# EAGLE schematic nixie (EAGLE 6.2)
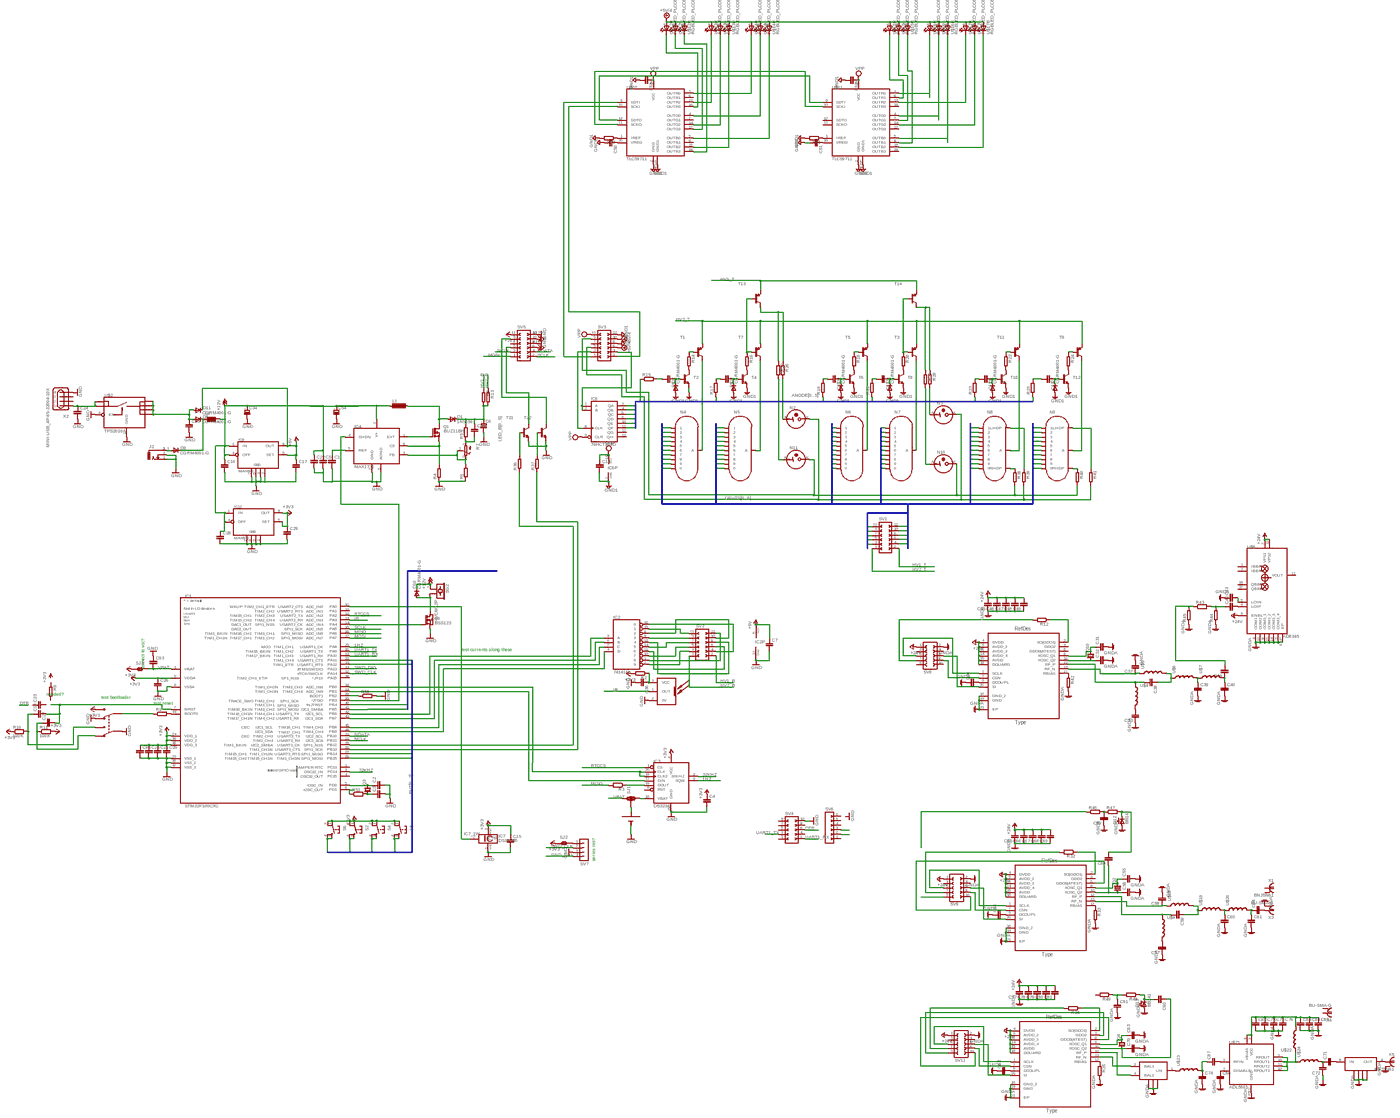
[diagram p0: schematic, sheet 1, overview]
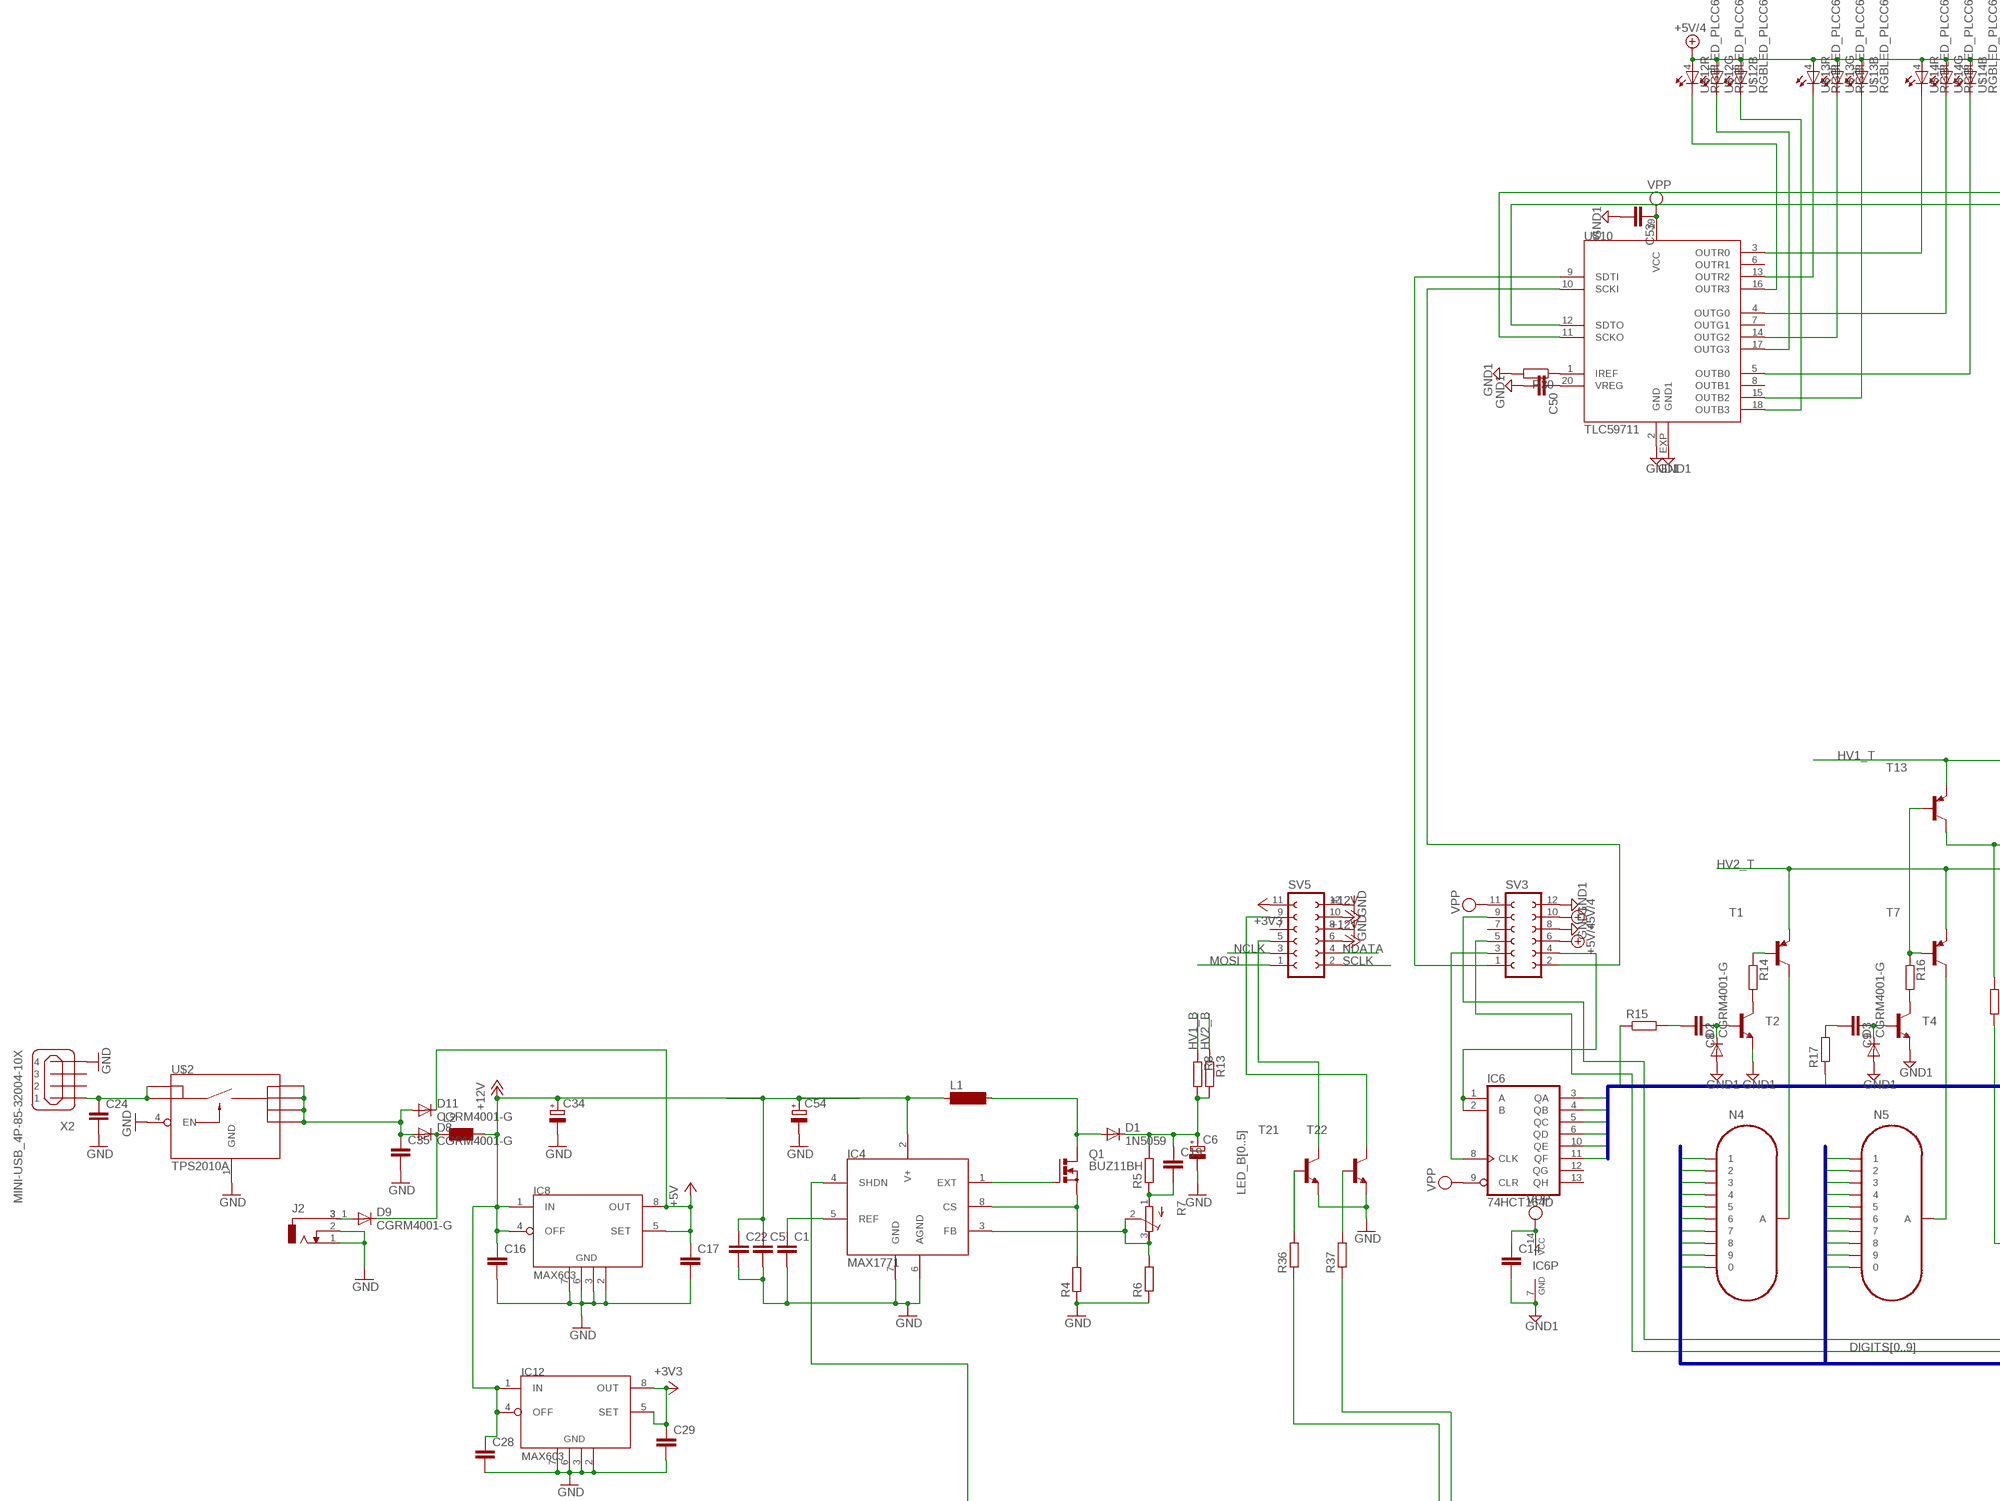
[diagram p1: schematic, sheet 1, part 1 of 4]
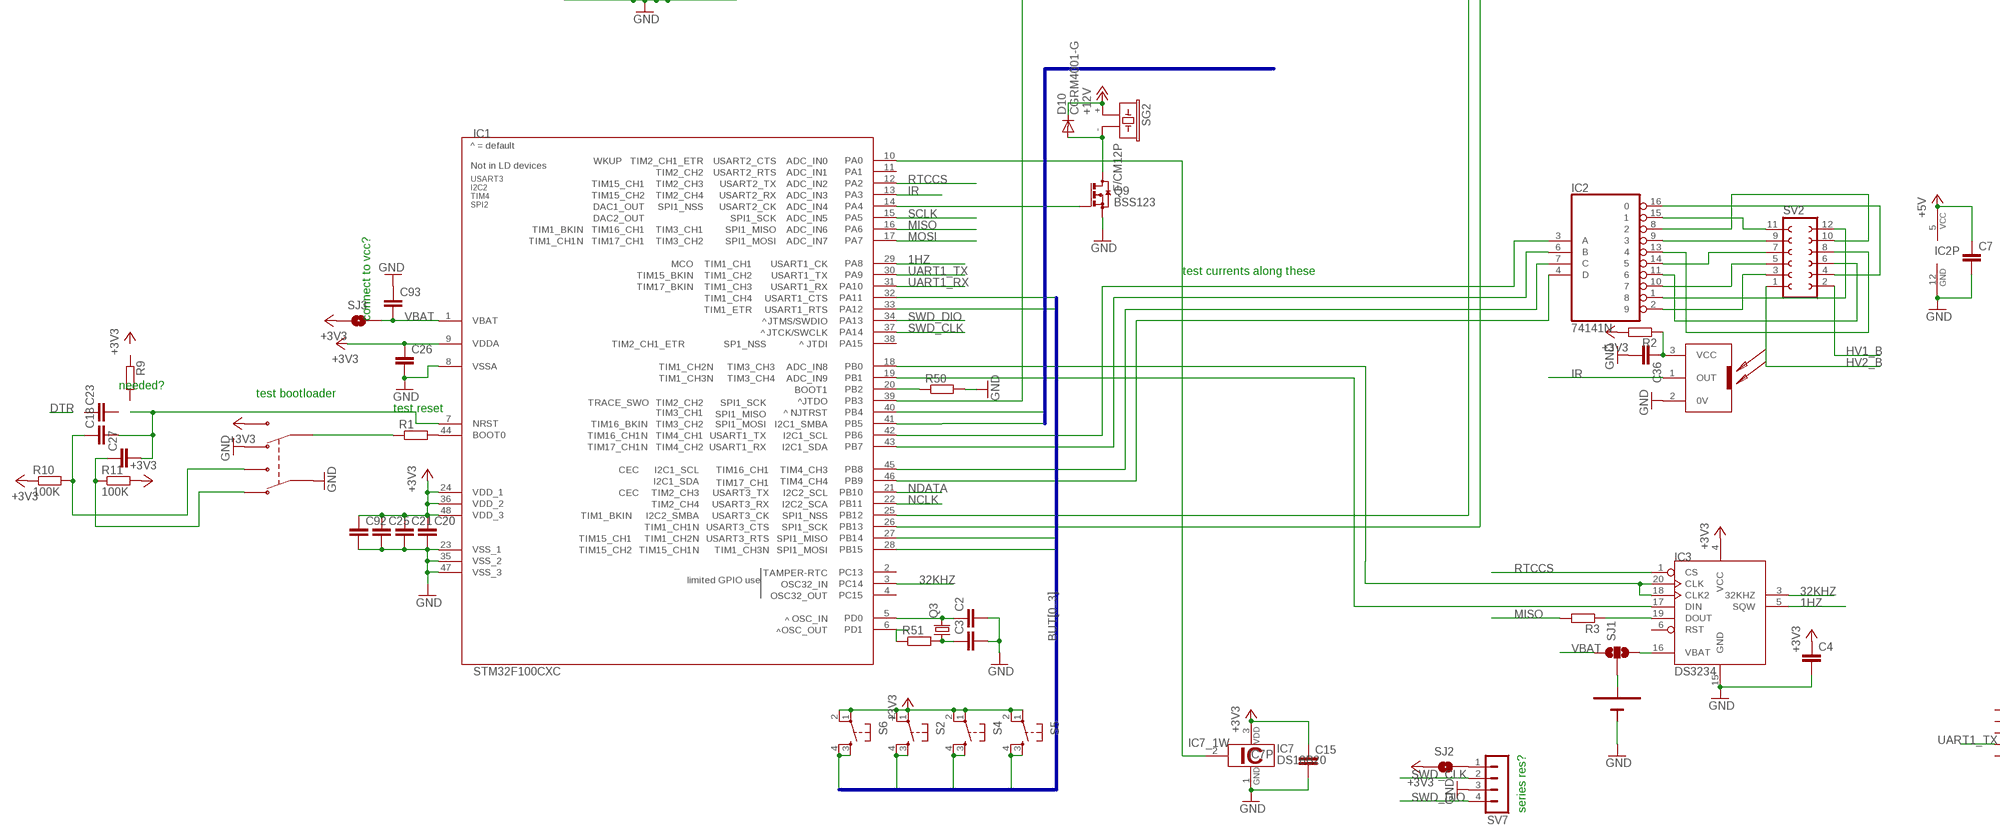
[diagram p2: schematic, sheet 1, part 2 of 4]
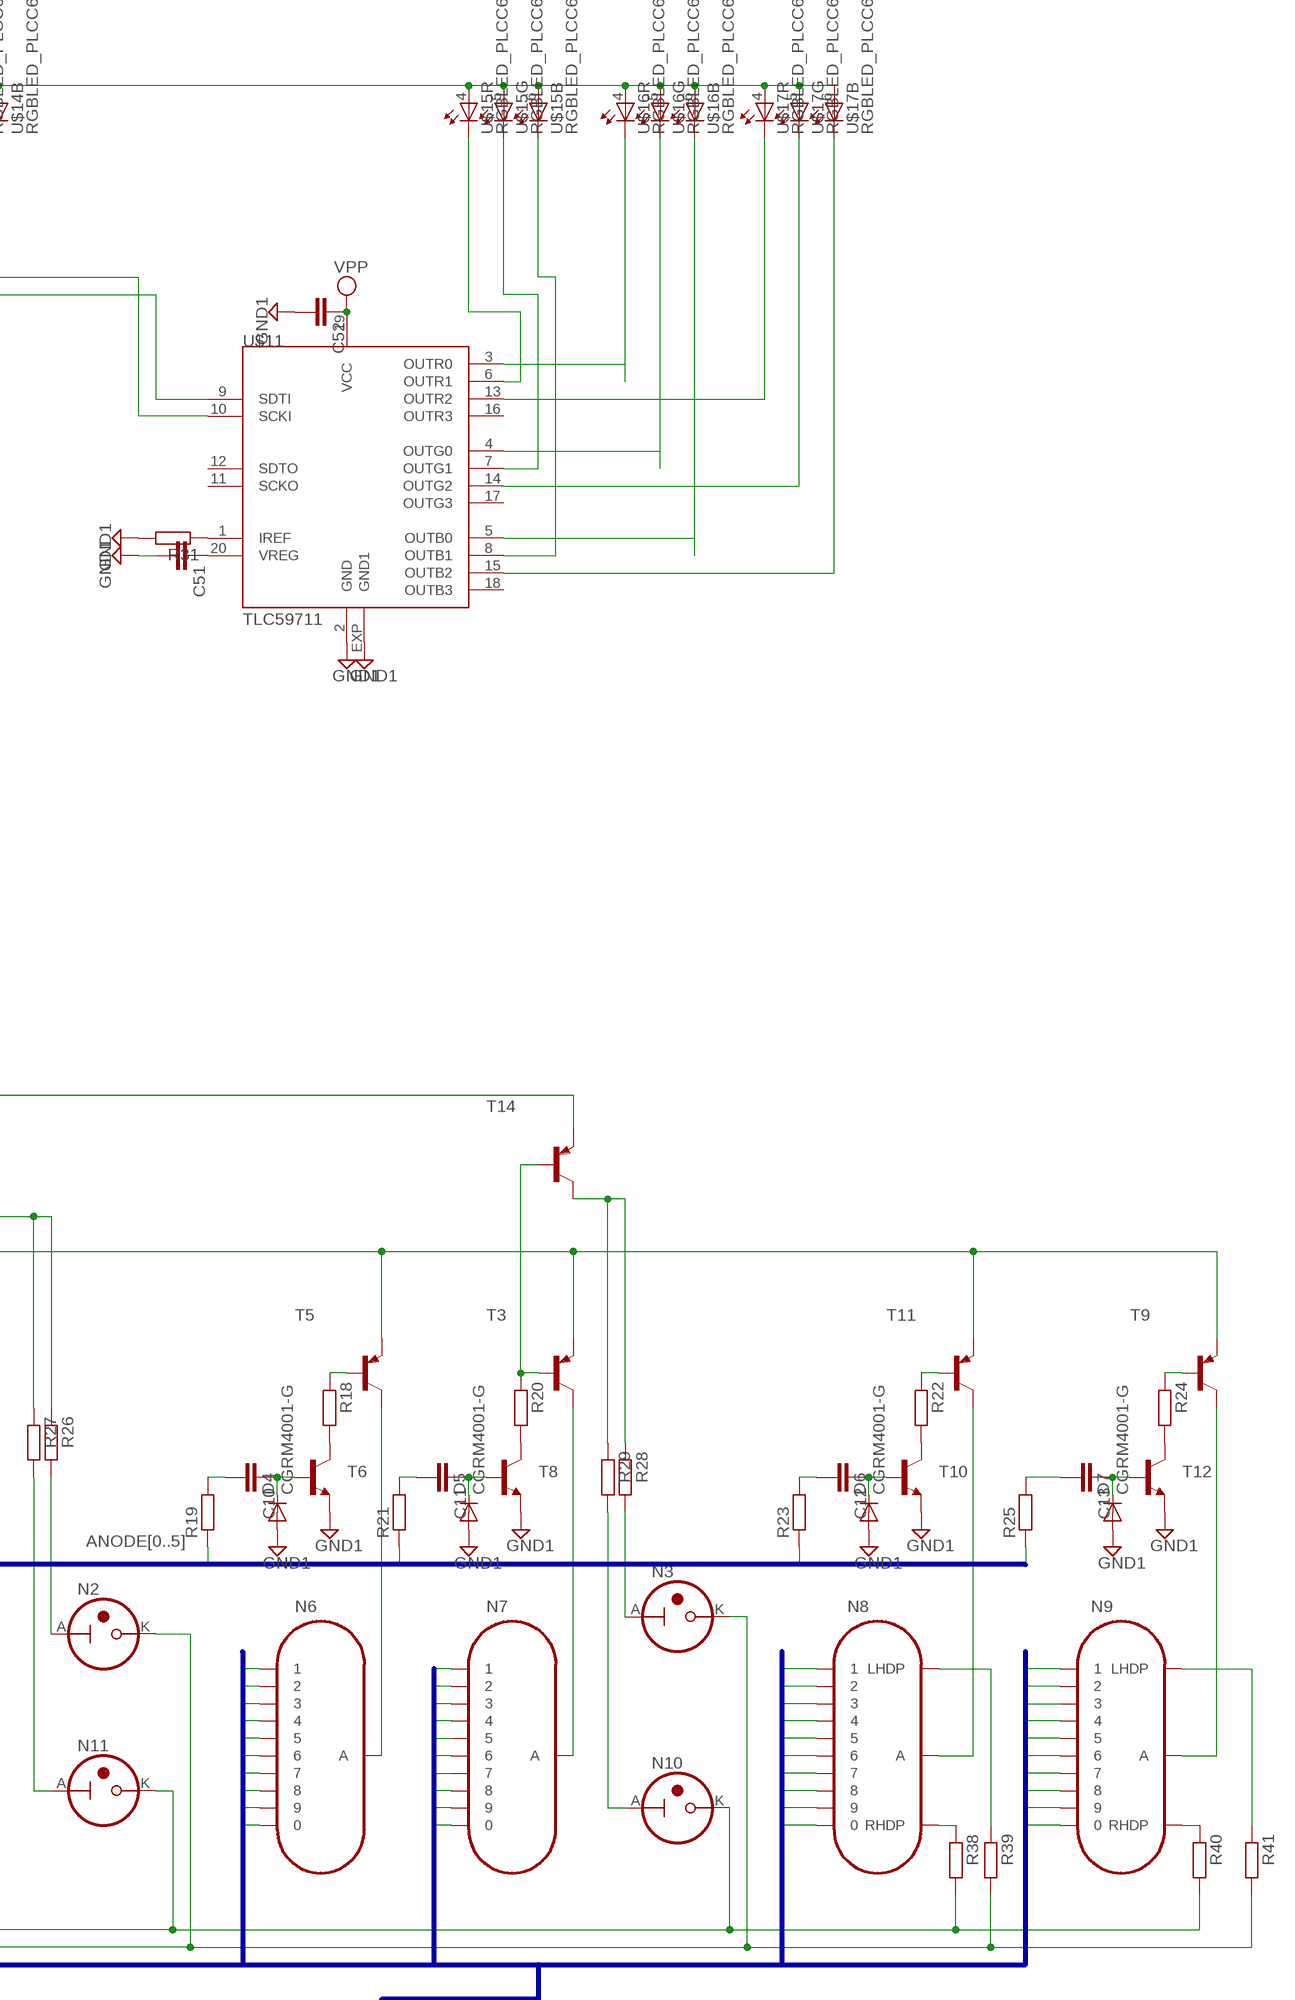
[diagram p3: schematic, sheet 1, part 3 of 4]
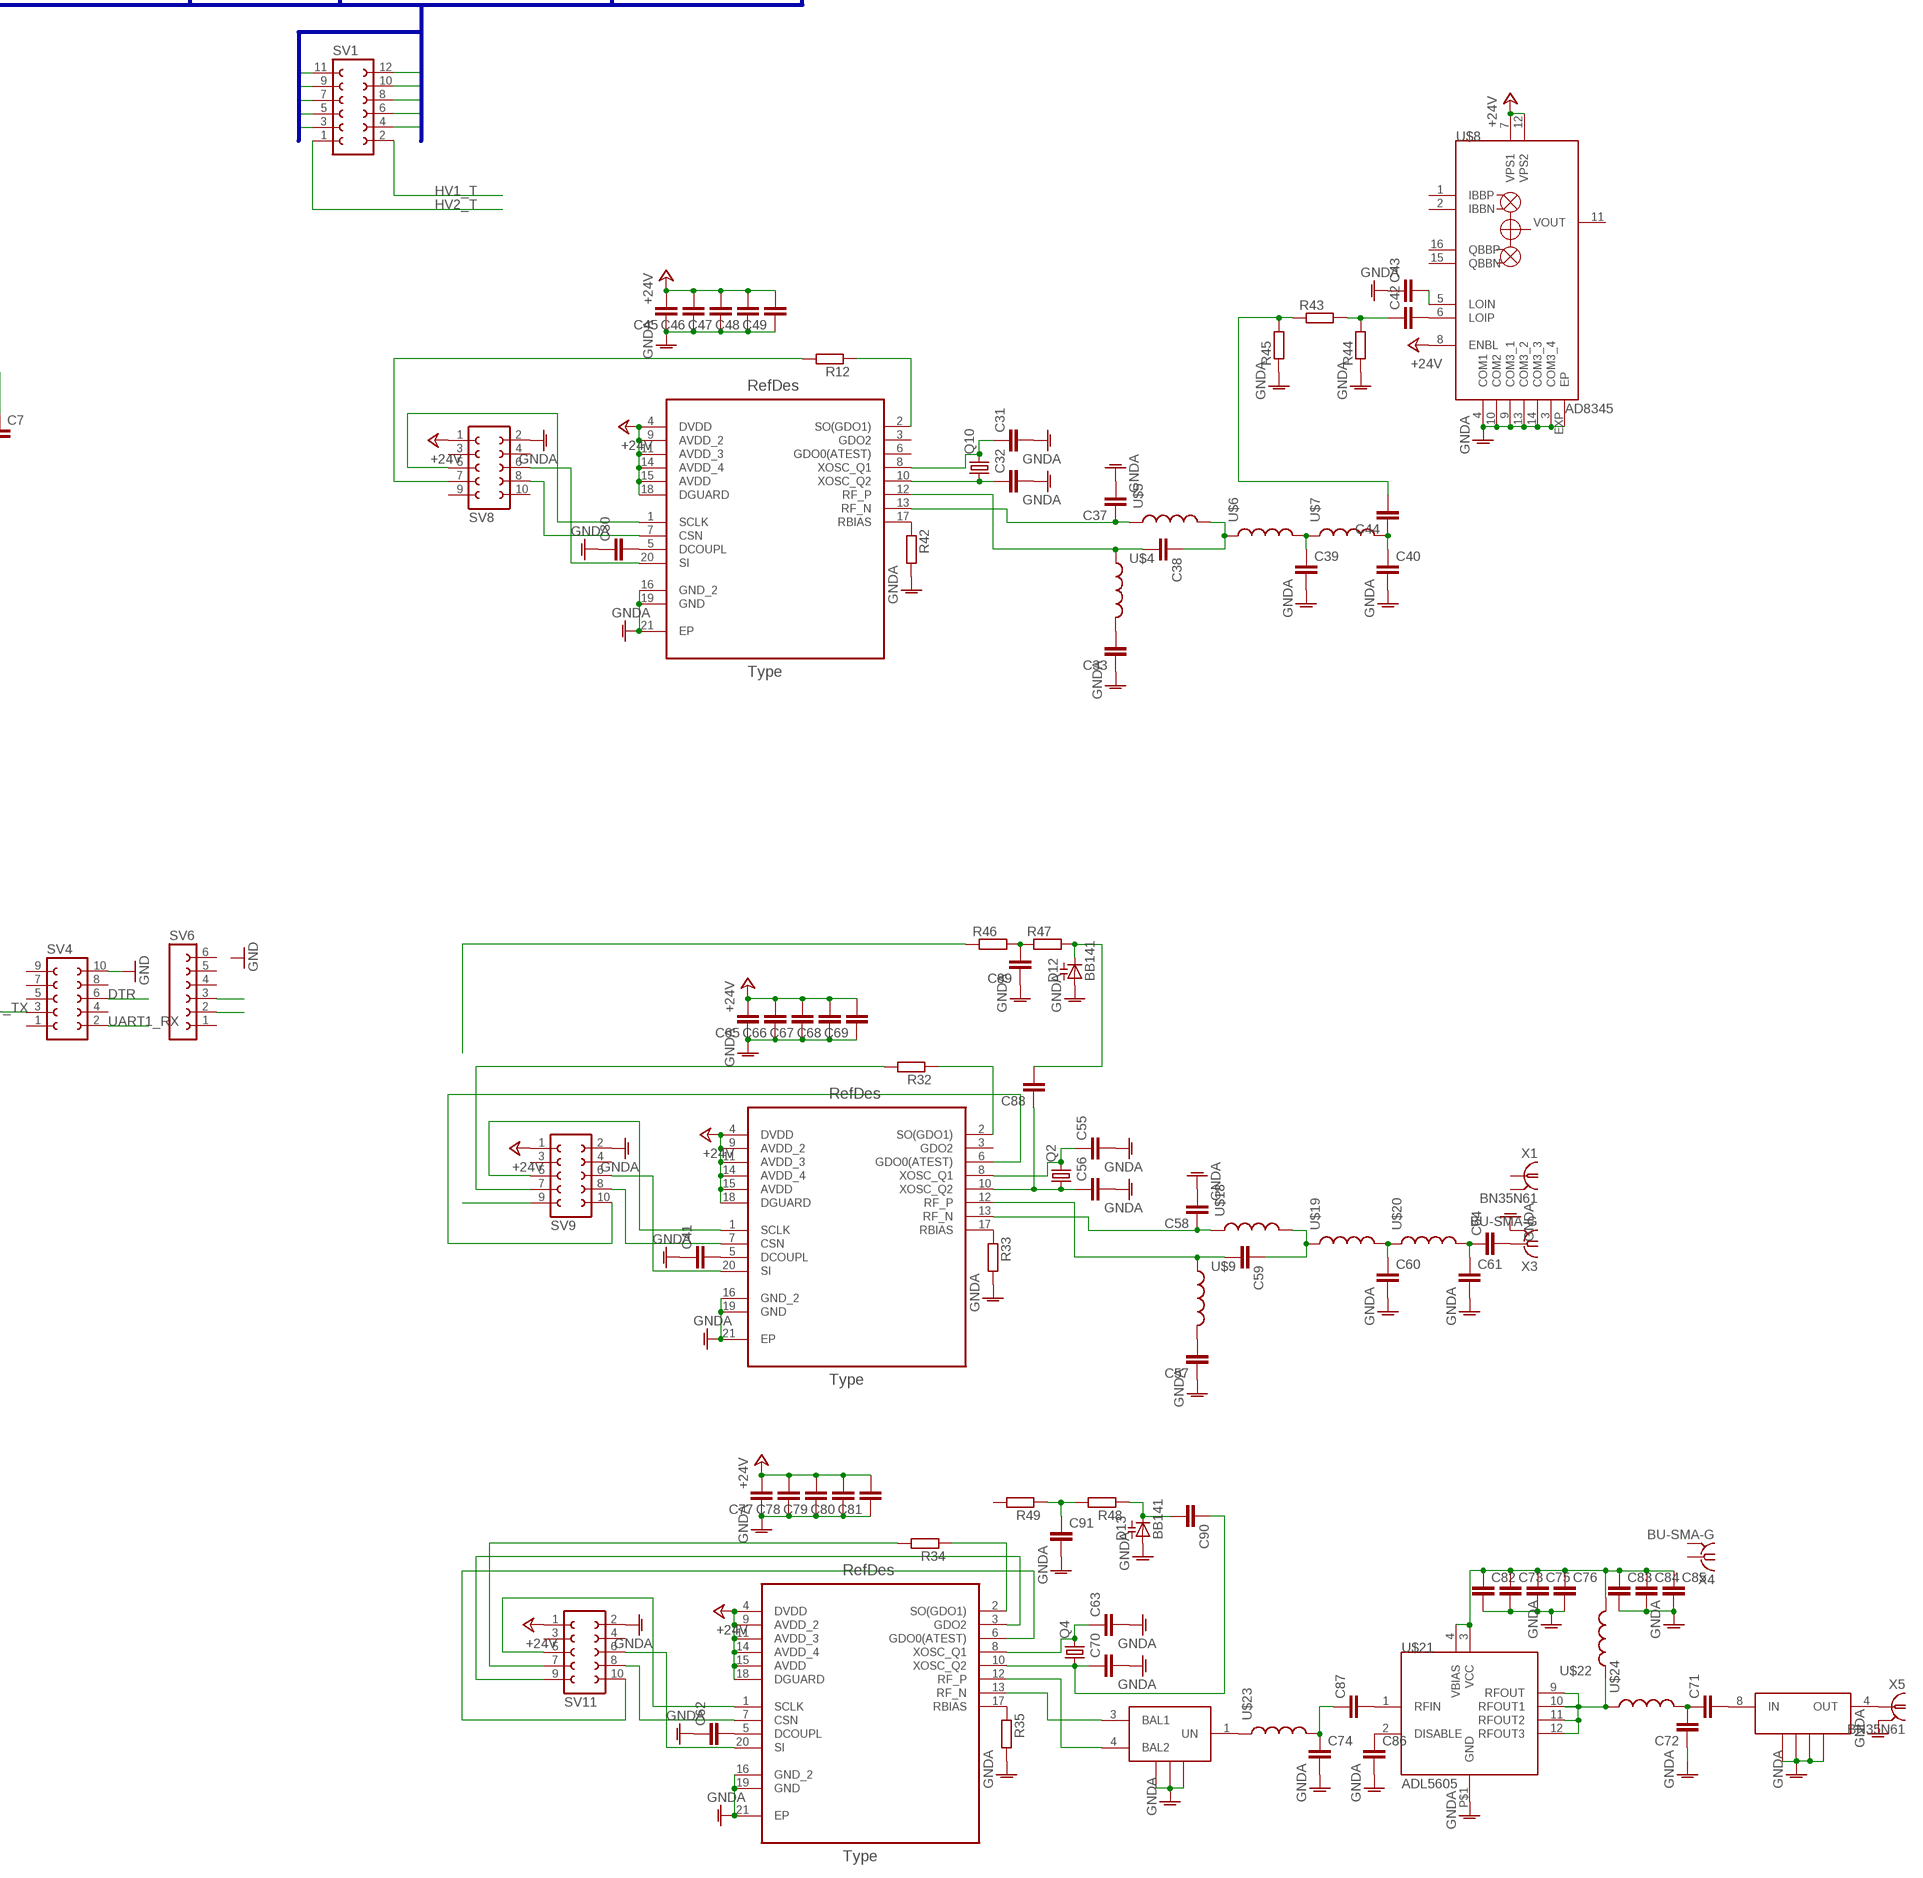
[diagram p4: schematic, sheet 1, part 4 of 4]

## Parts
BAT1  2032  [COIN]
C1  C-EUC0603  [C0603]
C2  C-EUC0603  [C0603]
C3  C-EUC0603  [C0603]
C4  C-EUC0603  [C0603]
C5  C-EUC0603  [C0603]
C6  CPOL-EUE2.5-6  [E2,5-6]
C7  C-EUC0603  [C0603]
C8  C-EUC0603  [C0603]
C9  C-EUC0603  [C0603]
C10  C-EUC0603  [C0603]
C11  C-EUC0603  [C0603]
C12  C-EUC0603  [C0603]
C13  C-EUC0603  [C0603]
C14  C-EUC0603  [C0603]
C15  C-EUC0603  [C0603]
C16  C-EUC0603  [C0603]
C17  C-EUC0603  [C0603]
C18  C-EUC0603  [C0603]
C19  C-EUC0603  [C0603]
C20  C-EUC0603  [C0603]
C21  C-EUC0603  [C0603]
C22  C-EUC0603  [C0603]
C23  C-EUC0603  [C0603]
C24  C-EUC1206  [C1206]
C25  C-EUC0603  [C0603]
C26  C-EUC0603  [C0603]
C27  C-EUC0603  [C0603]
C28  C-EUC0603  [C0603]
C29  C-EUC0603  [C0603]
C30  C-EUC0603  [C0603]
C31  C-EUC0603  [C0603]
C32  C-EUC0603  [C0603]
C33  C-EUC0603  [C0603]
C34  CPOL-EUSMCC  [SMC_C]
C35  C-EUC0603  [C0603]
C36  C-EUC0603  [C0603]
C37  C-EUC0603  [C0603]
C38  C-EUC0603  [C0603]
C39  C-EUC0603  [C0603]
C40  C-EUC0603  [C0603]
C41  C-EUC0603  [C0603]
C42  C-EUC0603  [C0603]
C43  C-EUC0603  [C0603]
C44  C-EUC0603  [C0603]
C45  C-EUC0603  [C0603]
C46  C-EUC0603  [C0603]
C47  C-EUC0603  [C0603]
C48  C-EUC0603  [C0603]
C49  C-EUC0603  [C0603]
C50  C-EUC0603  [C0603]
C51  C-EUC0603  [C0603]
C52  C-EUC0603  [C0603]
C53  C-EUC0603  [C0603]
C54  CPOL-EUE2.5-6  [E2,5-6]
C55  C-EUC0603  [C0603]
C56  C-EUC0603  [C0603]
C57  C-EUC0603  [C0603]
C58  C-EUC0603  [C0603]
C59  C-EUC0603  [C0603]
C60  C-EUC0603  [C0603]
C61  C-EUC0603  [C0603]
C62  C-EUC0603  [C0603]
C63  C-EUC0603  [C0603]
C64  C-EUC0603  [C0603]
C65  C-EUC0603  [C0603]
C66  C-EUC0603  [C0603]
C67  C-EUC0603  [C0603]
C68  C-EUC0603  [C0603]
C69  C-EUC0603  [C0603]
C70  C-EUC0603  [C0603]
C71  C-EUC0603  [C0603]
C72  C-EUC0603  [C0603]
C73  C-EUC0603  [C0603]
C74  C-EUC0603  [C0603]
C75  C-EUC0603  [C0603]
C76  C-EUC0603  [C0603]
C77  C-EUC0603  [C0603]
C78  C-EUC0603  [C0603]
C79  C-EUC0603  [C0603]
C80  C-EUC0603  [C0603]
C81  C-EUC0603  [C0603]
C82  C-EUC0603  [C0603]
C83  C-EUC0603  [C0603]
C84  C-EUC0603  [C0603]
C85  C-EUC0603  [C0603]
C86  C-EUC0603  [C0603]
C87  C-EUC0603  [C0603]
C88  C-EUC0603  [C0603]
C89  C-EUC0603  [C0603]
C90  C-EUC0603  [C0603]
C91  C-EUC0603  [C0603]
C92  C-EUC0603  [C0603]
C93  C-EUC0603  [C0603]
D1  1N5059  DIODE-C1702-05  [C1702-05]
D2  CGRM4001-G  DIODESOD  [SOD-323]
D3  CGRM4001-G  DIODESOD  [SOD-323]
D4  CGRM4001-G  DIODESOD  [SOD-323]
D5  CGRM4001-G  DIODESOD  [SOD-323]
D6  CGRM4001-G  DIODESOD  [SOD-323]
D7  CGRM4001-G  DIODESOD  [SOD-323]
D8  CGRM4001-G  [SOD-123_MINI-SMA]
D9  CGRM4001-G  [SOD-123_MINI-SMA]
D10  CGRM4001-G  [SOD-123_MINI-SMA]
D11  CGRM4001-G  [SOD-123_MINI-SMA]
D12  BB141  [SOD523]
D13  BB141  [SOD523]
IC1  STM32F100CXC  [SQFP-S-7X7-48]
IC2  74141N  [DIL16]
IC3  DS3234  [SO20W]
IC4  MAX1771  [SO08]
IC6  74HCT164D  [SO14]
IC7  DS18B20  [TO92-]
IC8  MAX603  [SO08]
IC12  MAX603  [SO08]
J2  DCJ0303SMD  [SMD_JACK]
L1  BS11  [BS11]
L2  WE-CBF_0805  [0805]
N2  IN-3  [IN-3]
N3  IN-3  [IN-3]
N4  IN-8  [IN-8]
N5  IN-8  [IN-8]
N6  IN-8  [IN-8]
N7  IN-8  [IN-8]
N8  IN-16  [IN-16]
N9  IN-16  [IN-16]
N10  IN-3  [IN-3]
N11  IN-3  [IN-3]
Q1  BUZ11BH  [TO220BH]
Q2  CRYSTAL5X3  [CRYSTAL-SMD-5X3]
Q3  CRYSTALCTS406  [CTS406]
Q4  CRYSTAL5X3  [CRYSTAL-SMD-5X3]
Q9  BSS123  [SOT23]
Q10  CRYSTAL5X3  [CRYSTAL-SMD-5X3]
R1  R-EU_R0603  [R0603]
R2  R-EU_R0603  [R0603]
R3  R-EU_R0603  [R0603]
R4  SMR-WAV  [SMS-WAV]
R5  R-EU_R0603  [R0603]
R6  R-EU_R0603  [R0603]
R7  R-TRIMM3314J  [RTRIM3314J]
R8  R-EU_R0805  [R0805]
R9  R-EU_R0805  [R0805]
R10  100K  R-EU_R0603  [R0603]
R11  100K  R-EU_R0603  [R0603]
R12  R-EU_R0603  [R0603]
R13  R-EU_R0805  [R0805]
R14  R-EU_R0603  [R0603]
R15  R-EU_R0603  [R0603]
R16  R-EU_R0603  [R0603]
R17  R-EU_R0603  [R0603]
R18  R-EU_R0603  [R0603]
R19  R-EU_R0603  [R0603]
R20  R-EU_R0603  [R0603]
R21  R-EU_R0603  [R0603]
R22  R-EU_R0603  [R0603]
R23  R-EU_R0603  [R0603]
R24  R-EU_R0603  [R0603]
R25  R-EU_R0603  [R0603]
R26  R-EU_R0603  [R0603]
R27  R-EU_R0603  [R0603]
R28  R-EU_R0603  [R0603]
R29  R-EU_R0603  [R0603]
R30  R-EU_R0603  [R0603]
R31  R-EU_R0603  [R0603]
R32  R-EU_R0603  [R0603]
R33  R-EU_R0603  [R0603]
R34  R-EU_R0603  [R0603]
R35  R-EU_R0603  [R0603]
R36  R-EU_R0603  [R0603]
R37  R-EU_R0603  [R0603]
R38  R-EU_R0603  [R0603]
R39  R-EU_R0603  [R0603]
R40  R-EU_R0603  [R0603]
R41  R-EU_R0603  [R0603]
R42  R-EU_R0603  [R0603]
R43  R-EU_R0603  [R0603]
R44  R-EU_R0603  [R0603]
R45  R-EU_R0603  [R0603]
R46  R-EU_R0603  [R0603]
R47  R-EU_R0603  [R0603]
R48  R-EU_R0603  [R0603]
R49  R-EU_R0603  [R0603]
R50  R-EU_R0603  [R0603]
R51  R-EU_R0603  [R0603]
S2  TAC_SWITCHPTH  [TACTILE-PTH]
S4  TAC_SWITCHPTH  [TACTILE-PTH]
S5  TAC_SWITCHPTH  [TACTILE-PTH]
S6  TAC_SWITCHPTH  [TACTILE-PTH]
SG2  F/CM12P  [F/CM12P]
SJ1  SOLDERJUMPER_2WAYS  [SJ_3]
SJ2  SOLDERJUMPERNO  [SJ_2S-NO]
SJ3  SOLDERJUMPERNO  [SJ_2S-NO]
SV1  FE06-2  [FE06-2]
SV2  FE06-2  [FE06-2]
SV3  FE06-2  [FE06-2]
SV4  FE05-2WED  [EDGE_10]
SV5  FE06-2  [FE06-2]
SV6  FE06-1ED  [EDGE_6]
SV7  MA04-1E  [EDGE_4]
SV8  FE05-2  [FE05-2]
SV9  FE05-2  [FE05-2]
SV11  FE05-2  [FE05-2]
T1  BC807-16-PNP-SOT23-BEC  [SOT23-BEC]
T2  TRANSISTOR_NPNSOT23-3  [SOT23-3]
T3  BC807-16-PNP-SOT23-BEC  [SOT23-BEC]
T4  TRANSISTOR_NPNSOT23-3  [SOT23-3]
T5  BC807-16-PNP-SOT23-BEC  [SOT23-BEC]
T6  TRANSISTOR_NPNSOT23-3  [SOT23-3]
T7  BC807-16-PNP-SOT23-BEC  [SOT23-BEC]
T8  TRANSISTOR_NPNSOT23-3  [SOT23-3]
T9  BC807-16-PNP-SOT23-BEC  [SOT23-BEC]
T10  TRANSISTOR_NPNSOT23-3  [SOT23-3]
T11  BC807-16-PNP-SOT23-BEC  [SOT23-BEC]
T12  TRANSISTOR_NPNSOT23-3  [SOT23-3]
T13  BC807-16-PNP-SOT23-BEC  [SOT23-BEC]
T14  BC807-16-PNP-SOT23-BEC  [SOT23-BEC]
T21  -NPN-TO92-EBC  [TO92-EBC]
T22  -NPN-TO92-EBC  [TO92-EBC]
U1  CC1101RTK  [QFN50P400X400X90-21N]
U2  CC1101RTK  [QFN50P400X400X90-21N]
U3  CC1101RTK  [QFN50P400X400X90-21N]
U$1  IRREC  [IRREC]
U$2  TPS2010A  [SO-08]
U$3  DPDTSLIDE  [DPDTSLIDE]
U$4  INDUCTOR0402  [C0402]
U$5  INDUCTOR0402  [C0402]
U$6  INDUCTOR0402  [C0402]
U$7  INDUCTOR0402  [C0402]
U$8  AD8345  [TSSOP16EXP]
U$9  INDUCTOR0402  [C0402]
U$10  TLC59711  [HTSSOP20PWP]
U$11  TLC59711  [HTSSOP20PWP]
U$12  RGBLED_PLCC6  [PLCC6]
U$13  RGBLED_PLCC6  [PLCC6]
U$14  RGBLED_PLCC6  [PLCC6]
U$15  RGBLED_PLCC6  [PLCC6]
U$16  RGBLED_PLCC6  [PLCC6]
U$17  RGBLED_PLCC6  [PLCC6]
U$18  INDUCTOR0402  [C0402]
U$19  INDUCTOR0402  [C0402]
U$20  INDUCTOR0402  [C0402]
U$21  ADL5605  [LFCSP_VQ_16]
U$22  INDUCTOR0402  [C0402]
U$23  INDUCTOR0402  [C0402]
U$24  INDUCTOR0402  [C0402]
X1  BN35N61  [B35N61]
X2  MINI-USB_4P-85-32004-10X  [85-32004-10X]
X3  BU-SMA-G  [BU-SMA-G]
X4  BU-SMA-G  [BU-SMA-G]
X5  BN35N61  [B35N61]
X6  LFL21902MTC1A018  [LFL21_TC]
X7  0896BM15A0001  [0896BM15A0001]

## Nets
1HZ: IC1.29(PA8) IC3.5(SQW)
32KHZ: IC1.3(PC14) IC3.3(32KHZ)
+3V3: C4.1 C15.1 C20.1 C21.1 C25.1 C26.1 C29.1 C92.1 IC1.9(VDDA) IC1.24(VDD_1) IC1.36(VDD_2) IC1.48(VDD_3) IC3.4(VCC) IC7.3 IC12.5(SET) IC12.8(OUT) R2.2 R10.1 R11.2 S2.1 S2.2 S4.1 S4.2 S5.1 S5.2 S6.1 S6.2 SJ2.1 SJ3.1 SV5.11 U$3.2B(NO1)
+5V: C7.1 C17.1 D11.C IC2.5(VCC) IC8.5(SET) IC8.8(OUT)
+5V/4: SV3.6 SV3.10 U$12.4(R:A) U$12.5(G:A) U$12.6(B:A) U$13.4(R:A) U$13.5(G:A) U$13.6(B:A) U$14.4(R:A) U$14.5(G:A) U$14.6(B:A) U$15.4(R:A) U$15.5(G:A) U$15.6(B:A) U$16.4(R:A) U$16.5(G:A) U$16.6(B:A) U$17.4(R:A) U$17.5(G:A) U$17.6(B:A)
+12V: C5.1 C16.1 C22.1 C28.1 C34.+ C54.+ D10.C IC4.2(V+) IC8.1(IN) IC8.4(OFF) IC12.1(IN) IC12.4(OFF) L1.1 L2.2 SG2.+ SV5.6 SV5.10
+24V: C45.2 C46.2 C47.2 C48.2 C49.2 C65.2 C66.2 C67.2 C68.2 C69.2 C77.2 C78.2 C79.2 C80.2 C81.2 SV8.1 SV9.1 SV11.1 U1.4(DVDD) U1.9(AVDD_2) U1.11(AVDD_3) U1.14(AVDD_4) U1.15(AVDD) U1.18(DGUARD) U2.4(DVDD) U2.9(AVDD_2) U2.11(AVDD_3) U2.14(AVDD_4) U2.15(AVDD) U2.18(DGUARD) U3.4(DVDD) U3.9(AVDD_2) U3.11(AVDD_3) U3.14(AVDD_4) U3.15(AVDD) U3.18(DGUARD) U$8.7(VPS1) U$8.8(ENBL) U$8.12(VPS2)
ANODE0: IC6.3(QA) R15.1
ANODE1: IC6.4(QB) R17.1
ANODE2: IC6.5(QC) R19.1
ANODE3: IC6.6(QD) R21.1
ANODE4: IC6.10(QE) R23.1
ANODE5: IC6.11(QF) R25.1
BUT0: IC1.32(PA11) S5.3 S5.4
BUT1: IC1.33(PA12) S6.3 S6.4
BUT2: IC1.28(PB15) S4.3 S4.4
BUT3: IC1.27(PB14) S2.3 S2.4
DIGITS0: N4.0 N5.0 N6.0 N7.0 N8.0 N9.0 SV1.3
DIGITS1: N4.1 N5.1 N6.1 N7.1 N8.1 N9.1 SV1.12
DIGITS2: N4.2 N5.2 N6.2 N7.2 N8.2 N9.2 SV1.5
DIGITS3: N4.3 N5.3 N6.3 N7.3 N8.3 N9.3 SV1.6
DIGITS4: N4.4 N5.4 N6.4 N7.4 N8.4 N9.4 SV1.7
DIGITS5: N4.5 N5.5 N6.5 N7.5 N8.5 N9.5 SV1.8
DIGITS6: N4.6 N5.6 N6.6 N7.6 N8.6 N9.6 SV1.9
DIGITS7: N4.7 N5.7 N6.7 N7.7 N8.7 N9.7 SV1.10
DIGITS8: N4.8 N5.8 N6.8 N7.8 N8.8 N9.8 SV1.11
DIGITS9: N4.9 N5.9 N6.9 N7.9 N8.9 N9.9 SV1.4
DTR: SV4.6
GND: BAT1.- C1.2 C2.2 C3.2 C4.2 C5.2 C6.- C7.2 C15.2 C16.2 C17.2 C20.2 C21.2 C22.2 C24.2 C25.2 C26.2 C28.2 C29.2 C34.- C35.2 C36.2 C54.- C92.2 C93.1 IC1.8(VSSA) IC1.23(VSS_1) IC1.35(VSS_2) IC1.47(VSS_3) IC2.12(GND) IC3.15(GND) IC4.6(AGND) IC4.7(GND) IC7.1 IC8.2(GND4) IC8.3(GND3) IC8.6(GND2) IC8.7(GND1) IC12.2(GND4) IC12.3(GND3) IC12.7(GND1) J2.1 J2.2 Q9.2(S) R4.2 R6.1 R50.2 SV4.10 SV5.8 SV5.12 SV7.3 T21.E T22.E U$1.2(0V) U$2.1(GND) U$2.4(EN) U$3.1X(COM0) U$3.2A(NC1) X2.4
GND1: C14.2 C50.2 C51.2 C52.2 C53.2 D2.2(A) D3.2(A) D4.2(A) D5.2(A) D6.2(A) D7.2(A) IC6.7(GND) R30.2 R31.2 SV3.8 SV3.12 T2.2(E) T4.2(E) T6.2(E) T8.2(E) T10.2(E) T12.2(E) U$10.2(GND) U$10.EXP(GND1) U$11.2(GND) U$11.EXP(GND1)
GNDA: C30.1 C31.2 C32.2 C33.1 C37.2 C39.2 C40.2 C41.1 C43.1 C45.1 C46.1 C47.1 C48.1 C49.1 C55.2 C56.2 C57.1 C58.2 C60.2 C61.2 C62.1 C63.2 C65.1 C66.1 C67.1 C68.1 C69.1 C70.2 C72.1 C73.2 C74.2 C75.2 C76.2 C77.1 C78.1 C79.1 C80.1 C81.1 C82.2 C83.2 C84.2 C85.2 C86.2 C89.1 C91.2 D12.A D13.A R33.2 R35.2 R42.2 R44.1 R45.1 SV8.2 SV9.2 SV11.2 U1.16(GND_2) U1.19(GND) U1.21(EP) U2.16(GND_2) U2.19(GND) U2.21(EP) U3.16(GND_2) U3.19(GND) U3.21(EP) U$8.3(COM3_4) U$8.4(COM1) U$8.9(COM3_1) U$8.10(COM2) U$8.13(COM3_2) U$8.14(COM3_3) U$8.EXP(EP) U$21.P$1(GND) X3.2(GND) X5.2(GND) X6.1(GND1) X6.3(GND2) X6.5(GND3) X6.7(GND) X7.2(GND2) X7.5(GND) X7.6(GND1)
HV1_B: R8.1 SV2.2
HV1_T: SV1.2 T13.E T14.E
HV2_B: R13.1 SV2.1
HV2_T: SV1.1 T1.E T3.E T5.E T7.E T9.E T11.E
IR: IC1.13(PA3) U$1.1(OUT)
LED5: SV3.2 U$10.10(SCKI)
LED_B0: IC1.41(PB5)
LED_B1: IC1.40(PB4)
MISO: IC1.16(PA6) R3.2
MOSI: IC1.17(PA7) SV5.1
N$1: C41.2 U2.5(DCOUPL)
N$2: IC6.1(A) IC6.2(B) SV3.4
N$3: BAT1.+ SJ1.2
N$4: IC1.25(PB12) R36.1
N$5: IC3.19(DOUT) R3.1
N$6: IC1.42(PB6) IC2.3(A)
N$7: IC3.16(VBAT) SJ1.3
N$8: IC1.19(PB1) IC3.17(DIN)
N$9: IC1.18(PB0) IC3.18(CLK2) IC3.20(CLK)
N$10: IC1.43(PB7) IC2.6(B)
N$11: IC1.45(PB8) IC2.7(C)
N$12: IC1.46(PB9) IC2.4(D)
N$13: IC4.1(EXT) Q1.G
N$14: IC4.8(CS) Q1.S R4.1
N$15: D1.A L1.2 Q1.D
N$16: N3.A R28.2
N$17: C1.1 IC4.5(REF)
N$18: R14.2 T2.3(C)
N$19: SV3.1 U$10.9(SDTI)
N$20: C19.2 R5.1 R7.1(E)
N$21: IC4.3(FB) R6.2 R7.2(S) R7.3(A)
N$22: R14.1 T1.B
N$23: C2.1 IC1.5(PD0) Q3.3
N$24: IC1.44(BOOT0) R1.2
N$25: N4.A T1.C
N$26: C6.+ C19.1 D1.C R5.2 R8.2 R13.2
N$27: C13.1 D7.1(C) T12.1(B)
N$28: N5.A T7.C
N$29: R16.2 T4.3(C)
N$30: R16.1 T7.B T13.B
N$31: C13.2 R25.2
N$32: N6.A T5.C
N$33: R18.2 T6.3(C)
N$34: R18.1 T5.B
N$35: C12.1 D6.1(C) T10.1(B)
N$36: R28.1 R29.1 T14.C
N$37: R20.2 T8.3(C)
N$38: R20.1 T3.B T14.B
N$39: C12.2 R23.2
N$40: N8.A T11.C
N$41: R22.2 T10.3(C)
N$42: R22.1 T11.B
N$43: C11.1 D5.1(C) T8.1(B)
N$44: N9.A T9.C
N$45: R24.2 T12.3(C)
N$46: R24.1 T9.B
N$47: C11.2 R21.2
N$48: IC1.6(PD1) R51.1
N$49: SV9.5 U2.1(SCLK)
N$50: SV9.8 U2.7(CSN)
N$51: SJ2.2 SV7.1
N$52: D9.A J2.3 J2.3_1
N$53: N2.A R26.2
N$54: N11.A R27.2
N$55: D10.A Q9.3(D) SG2.-
N$56: N10.A R29.2
N$57: N10.K N11.K R38.2 R40.2 SV3.9
N$58: C30.2 U1.5(DCOUPL)
N$59: SV9.6 U2.20(SI)
N$60: C56.1 C88.1 Q2.1 U2.10(XOSC_Q2)
N$61: C55.1 Q2.3 U2.8(XOSC_Q1)
N$62: R32.1 U2.2(SO(GDO1))
N$63: R32.2 SV9.7
N$64: C24.1 U$2.2(IN1) U$2.3(IN2) X2.1
N$65: SV8.5 U1.1(SCLK)
N$66: R37.2 T22.B
N$67: R36.2 T21.B
N$68: C18.2 C27.2 IC1.7(NRST)
N$69: C35.1 D8.A D11.A U$2.5(OUT1) U$2.6(OUT2) U$2.7(OUT3) U$2.8(OUT4)
N$70: IC1.14(PA4) Q9.1(G)
N$71: C27.1 R11.1 U$3.1A(NC0)
N$72: SV8.8 U1.7(CSN)
N$73: C18.1 R10.2 U$3.1B(NO0)
N$74: IC1.26(PB13) R37.1
N$75: SV8.6 U1.20(SI)
N$76: C10.1 D4.1(C) T6.1(B)
N$77: C10.2 R19.2
N$78: C9.1 D3.1(C) T4.1(B)
N$79: C32.1 Q10.1 U1.10(XOSC_Q2)
N$80: C9.2 R17.2
N$81: C8.1 D2.1(C) T2.1(B)
N$82: C8.2 R15.2
N$83: N8.RHDP R38.1
N$84: N8.LHDP R39.1
N$85: N9.RHDP R40.1
N$86: N9.LHDP R41.1
N$87: C57.2 U$9.2
N$88: N2.K N3.K R39.2 R41.2 SV3.5
N$89: C31.1 Q10.3 U1.8(XOSC_Q1)
N$90: C33.2 U$4.2
N$91: IC1.10(PA0) IC7.2
N$92: R26.1 R27.1 T13.C
N$93: C39.1 U$6.2 U$7.1
N$94: IC2.16 SV2.4
N$95: N7.A T3.C
N$96: IC2.15 SV2.11
N$97: IC2.9 SV2.9
N$98: IC2.14 SV2.7
N$99: IC2.10 SV2.5
N$100: IC2.8 SV2.10
N$101: IC2.2 SV2.3
N$102: IC2.1 SV2.12
N$103: R12.1 U1.2(SO(GDO1))
N$104: IC2.11 SV2.6
N$105: IC2.13 SV2.8
N$106: R12.2 SV8.7
N$107: C40.1 C44.1 U$7.2
N$108: C38.1 U$5.2 U$6.1
N$109: C37.1 U1.13(RF_N) U$5.1
N$110: C38.2 U1.12(RF_P) U$4.1
N$111: C42.2 U$8.6(LOIP)
N$112: IC6.8(CLK) SV3.3
N$113: SV5.5 T21.C
N$114: SV5.9 T22.C
N$115: R42.1 U1.17(RBIAS)
N$116: C42.1 R43.2 R44.2
N$117: C44.2 R43.1 R45.2
N$118: C43.2 U$8.5(LOIN)
N$119: C60.1 U$19.2 U$20.1
N$120: C61.1 C64.1 U$20.2
N$121: C59.1 U$18.2 U$19.1
N$122: C58.1 U2.13(RF_N) U$18.1
N$123: U$10.16(OUTR3) U$12.3(R:B)
N$124: D8.C D9.C L2.1
N$125: U$10.13(OUTR2) U$13.3(R:B)
N$126: U$10.3(OUTR0) U$14.3(R:B)
N$127: U$10.17(OUTG3) U$12.2(G:B)
N$128: U$10.14(OUTG2) U$13.2(G:B)
N$129: IC1.39(PB3) IC4.4(SHDN)
N$130: U$10.4(OUTG0) U$14.2(G:B)
N$131: C36.1 R2.1 U$1.3(VCC)
N$132: U$10.18(OUTB3) U$12.1(B:B)
N$133: U$10.15(OUTB2) U$13.1(B:B)
N$134: U$10.5(OUTB0) U$14.1(B:B)
N$135: U$11.6(OUTR1) U$15.3(R:B)
N$136: U$11.3(OUTR0) U$16.3(R:B)
N$137: U$11.13(OUTR2) U$17.3(R:B)
N$138: U$11.7(OUTG1) U$15.2(G:B)
N$139: U$11.4(OUTG0) U$16.2(G:B)
N$140: U$11.14(OUTG2) U$17.2(G:B)
N$141: U$11.8(OUTB1) U$15.1(B:B)
N$142: U$11.5(OUTB0) U$16.1(B:B)
N$143: U$11.15(OUTB2) U$17.1(B:B)
N$144: C50.1 U$10.20(VREG)
N$145: R30.1 U$10.1(IREF)
N$146: C51.1 U$11.20(VREG)
N$147: R31.1 U$11.1(IREF)
N$148: U$10.12(SDTO) U$11.9(SDTI)
N$149: U$10.11(SCKO) U$11.10(SCKI)
N$150: C59.2 U2.12(RF_P) U$9.1
N$151: R33.1 U2.17(RBIAS)
N$152: C64.2 X3.1
N$153: SV9.9
N$154: SV9.10 U2.6(GDO0(ATEST))
N$155: C62.2 U3.5(DCOUPL)
N$156: SV11.5 U3.1(SCLK)
N$157: SV11.8 U3.7(CSN)
N$158: SV11.6 U3.20(SI)
N$159: C70.1 C90.1 Q4.1 U3.10(XOSC_Q2)
N$160: C63.1 Q4.3 U3.8(XOSC_Q1)
N$161: R34.1 U3.2(SO(GDO1))
N$162: R34.2 SV11.7
N$163: U3.12(RF_P) X7.4(BAL2)
N$164: C74.1 C87.1 U$23.2
N$165: U3.13(RF_N) X7.3(BAL1)
N$166: U$23.1 X7.1(UN)
N$167: C87.2 U$21.1(RFIN)
N$168: C71.2 X6.8(IN)
N$169: R35.1 U3.17(RBIAS)
N$170: U$21.9(RFOUT) U$21.10(RFOUT1) U$21.11(RFOUT2) U$21.12(RFOUT3) U$22.1 U$24.1
N$171: SV11.9 U3.3(GDO2)
N$172: SV11.10 U3.6(GDO0(ATEST))
N$173: X5.1 X6.4(OUT)
N$174: C71.1 C72.2 U$24.2
N$175: C73.1 C75.1 C76.1 C82.1 C83.1 C84.1 C85.1 U$21.3(VCC) U$21.4(VBIAS) U$22.2
N$176: C88.2 D12.C R47.2
N$177: C86.1 U$21.2(DISABLE)
N$178: C89.2 R46.2 R47.1
N$179: R46.1
N$180: C91.1 R48.2 R49.1
N$181: C90.2 D13.C R48.1
N$182: R1.1 U$3.2X(COM1)
N$183: IC1.20(PB2) R50.1
N$184: C3.1 Q3.1 R51.2
NCLK: IC1.22(PB11) SV5.3
NDATA: IC1.21(PB10) SV5.4
RTCCS: IC1.12(PA2) IC3.1(CS)
RXD: SV6.2
SCLK: IC1.15(PA5) SV5.2
SWD_CLK: IC1.37(PA14) SV7.2
SWD_DIO: IC1.34(PA13) SV7.4
TXD: SV6.3
UART1_RX: IC1.31(PA10) SV4.2
UART1_TX: IC1.30(PA9) SV4.3
VBAT: C93.2 IC1.1(VBAT) SJ1.1 SJ3.2
VPP: C14.1 C52.1 C53.1 IC6.9(CLR) IC6.14(VCC) SV3.11 U$10.19(VCC) U$11.19(VCC)
Unconnected: C23.1 C23.2 IC1.2(PC13) IC1.4(PC15) IC1.11(PA1) IC1.38(PA15) IC3.6(RST) IC6.12(QG) IC6.13(QH) R9.1 R9.2 R49.2 SV3.7 SV4.1 SV4.4 SV4.5 SV4.7 SV4.8 SV4.9 SV5.7 SV6.1 SV6.4 SV6.5 SV6.6 SV8.3 SV8.4 SV8.9 SV8.10 SV9.3 SV9.4 SV11.3 SV11.4 U1.3(GDO2) U1.6(GDO0(ATEST)) U2.3(GDO2) U$8.1(IBBP) U$8.2(IBBN) U$8.11(VOUT) U$8.15(QBBN) U$8.16(QBBP) U$10.6(OUTR1) U$10.7(OUTG1) U$10.8(OUTB1) U$11.11(SCKO) U$11.12(SDTO) U$11.16(OUTR3) U$11.17(OUTG3) U$11.18(OUTB3) X1.1 X2.2 X2.3 X4.1

## Buses
DIGITS[0..9]
ANODE[0..5]
LED_B[0..5]
BUT[0..3]

## Notes on the sheet
- test currents along these
- connect to vcc?
- needed? | test bootloader
- test reset
- series res?

## Power pins joined to a net without a drawn wire
GND: X1.2(GND) X1.3(GND) X1.4(GND) X1.5(GND) X3.3(GND) X3.4(GND) X3.5(GND) X4.2(GND) X4.3(GND) X4.4(GND) X4.5(GND) X5.3(GND) X5.4(GND) X5.5(GND)
GND2: IC12.6(GND2)

## Library data of the parts
BAT1 = Mine:2032
C1-C5 C7-C33 C35-C53 C55-C93 = rcl:C-EU: CAPACITOR, European symbol
C6 C34 C54 = rcl:CPOL-EU: POLARIZED CAPACITOR, European symbol
D1 = diode:DIODE-: DIODE
D2-D7 = SparkFun:DIODE: Diode These are standard reverse protection diodes and small signal diodes. SMA package can handle up to about 1A. SOD-323 can handle about 200mA. What the SOD-323 package when ordering, there are some mfgs out there that are 5-pin packages.
D8-D11 = diode:CGRM400*-G: Molded plasitc,JEDEC SOD-123/Mini SMA Source: Comchip CGRM4001-G.pdf
D12 D13 = diode:BB141: Capacity DIODE variable-capacitance diode
IC1 = Mine:STM32F100CX
IC2 = 74xx-us:74*141: BCD to decimal DECODER/DRIVER
IC3 = Mine:DS3234
IC4 = Mine:MAX1771
IC6 = 74xx-eu:74*164: 8-bit parallel out SHIFT REGISTER
IC7 = 1wire:DS18B20: Programmable Resolution Digital Thermometer This chip provides a onewire thermosensor with approx. 0.5°C accuracy. A programmable over/undertemperure alarm is available. The precision can be set from 9..12 bits. Notes: Vdd must be applied for accurate measurements at low temperatures, as the parasite power circuit otherwise heats the sensor. If parasite power is used, Vdd has to be connected to GND. The DS1822 is a low-cost thermometer chip, the DS18S20 is similar to the DS18B20, but with 9 Bit precision only. Author: Jan Kandziora <jjj@gmx.de>
IC8 IC12 = Mine:MAX603
J2 = Mine:DCJ0303: DC POWER JACK Source: DCJ0303.pdf
L1 = inductor-neosid:BS: INDUCTOR nominal inductance, magnetically screened; OC_FARNELL: unknown; OC_NEWARK: unknown
L2 = wuerth-elektronik:WE-CBF: SMD EMI Suppression Ferrite Beads - excellent anti-EMI properties - low DCR - impedances till 3000 ohms - rated current up to 6 A
N2 N3 N10 N11 = russian-nixies:IN-3: IN-3: nixie bulb
N4-N7 = IN8:IN-8: IN-8: medium numeric frontview nixie tube
N8 N9 = russian-nixies:IN-16: IN-16: small numeric frontview nixie tube
Q1 = Mine:BUZ11: N-CHANNEL MOS FET
Q2 Q4 Q10 = SparkFun:CRYSTAL: Crystals Various standard crystals. Proven footprints. Spark Fun Electronics SKU : COM-00534
Q3 = crystal:CRYSTAL: CRYSTAL; OC_FARNELL: unknown; OC_NEWARK: unknown
Q9 = transistor-small-signal:BSS123: N-CHANNEL MOS FET
R1-R3 R5 R6 R8-R51 = rcl:R-EU_: RESISTOR, European symbol
R4 = resistor-shunt:SMR-WAV: SMD SHUNT RESISTOR; OC_FARNELL: unknown; OC_NEWARK: unknown
R7 = rcl:R-TRIMM: Trimm resistor
S2 S4-S6 = SparkFun:TAC_SWITCH: Momentary Switch Button commonly used for reset or general input. Spark Fun Electronics SKU : COM-00097
SG2 = buzzer:F/CM12P: BUZZER Source: Buerklin; OC_FARNELL: unknown; OC_NEWARK: unknown
SJ1 = SparkFun:SOLDERJUMPER_2WAY: Solder Jumper 2 way solder jumper
SJ2 SJ3 = SparkFun:SOLDERJUMPER: Solder Jumper Standard SMD solder jumper. Used to automate production. Two varients : Normally Open and Normally Closed are the same, but have different paste layers. NC will have a large amount of paste and should jumper during reflow.
SV1-SV3 SV5 = con-lsta:FE06-2: FEMALE HEADER; OC_FARNELL: unknown; OC_NEWARK: unknown
SV4 = Mine:FE05-2W: FEMALE HEADER
SV6 = Mine:FE06-1: FEMALE HEADER
SV7 = Mine:MA04-1: PIN HEADER
SV8 SV9 SV11 = con-lsta:FE05-2: FEMALE HEADER; OC_FARNELL: unknown; OC_NEWARK: unknown
T1 T3 T5 T7 T9 T11 T13 T14 = transistor:*-PNP-: PNP Transistror
T2 T4 T6 T8 T10 T12 = SparkFun:TRANSISTOR_NPN: Transistor NPN BJT configuration in SOT23 package. MMBT2222 is the common NPN we use. Double check BCE configuration again layout.
T21 T22 = transistor:*-NPN-: NPN Transistror BF959 corrected 2008.03.06
U1-U3 = cc1101:CC1101RTK; DESCRIPTION: Low-Power Sub-1 GHz RF Transceiver; MPN: CC1101RTK; OC_FARNELL: 1555264; OC_NEWARK: 50M8833; PACKAGE: QFN-20; SUPPLIER: Texas Instruments
U$1 = Mine:IRREC
U$2 = Mine:TPS2010A
U$3 = Mine:DPDTSLIDE
U$4-U$7 U$9 U$18-U$20 U$22-U$24 = SparkFun:INDUCTOR: Inductors Basic Inductor/Choke - 0603 and 1206. Footprints are not proven and vary greatly between part numbers.
U$8 = ad8345 - Copy:AD8345
U$10 U$11 = IN8:TLC59711
U$12-U$17 = IN8:RGBLED_PLCC6
U$21 = ad8345:ADL5605
X1 X5 = con-coax:BN35N61: BNC CONNECTOR M/A COM www.macom.com distributor Farnell 149-452; OC_FARNELL: unknown; OC_NEWARK: unknown
X2 = con-cypressindustries:MINI-USB_4P-: MINI USB 4 Pol. Source: www.cypressindustries.com; OC_FARNELL: unknown; OC_NEWARK: unknown
X3 X4 = con-coax:BU-SMA-G: FEMALE SMA CONNECTOR Radiall distributor RS 193-9117; OC_FARNELL: unknown; OC_NEWARK: unknown
X6 = ad8345:LFL21902MTC1A018
X7 = ad8345:0896BM15A0001